# Altium project 单片机+1602+键盘.PrjPCB
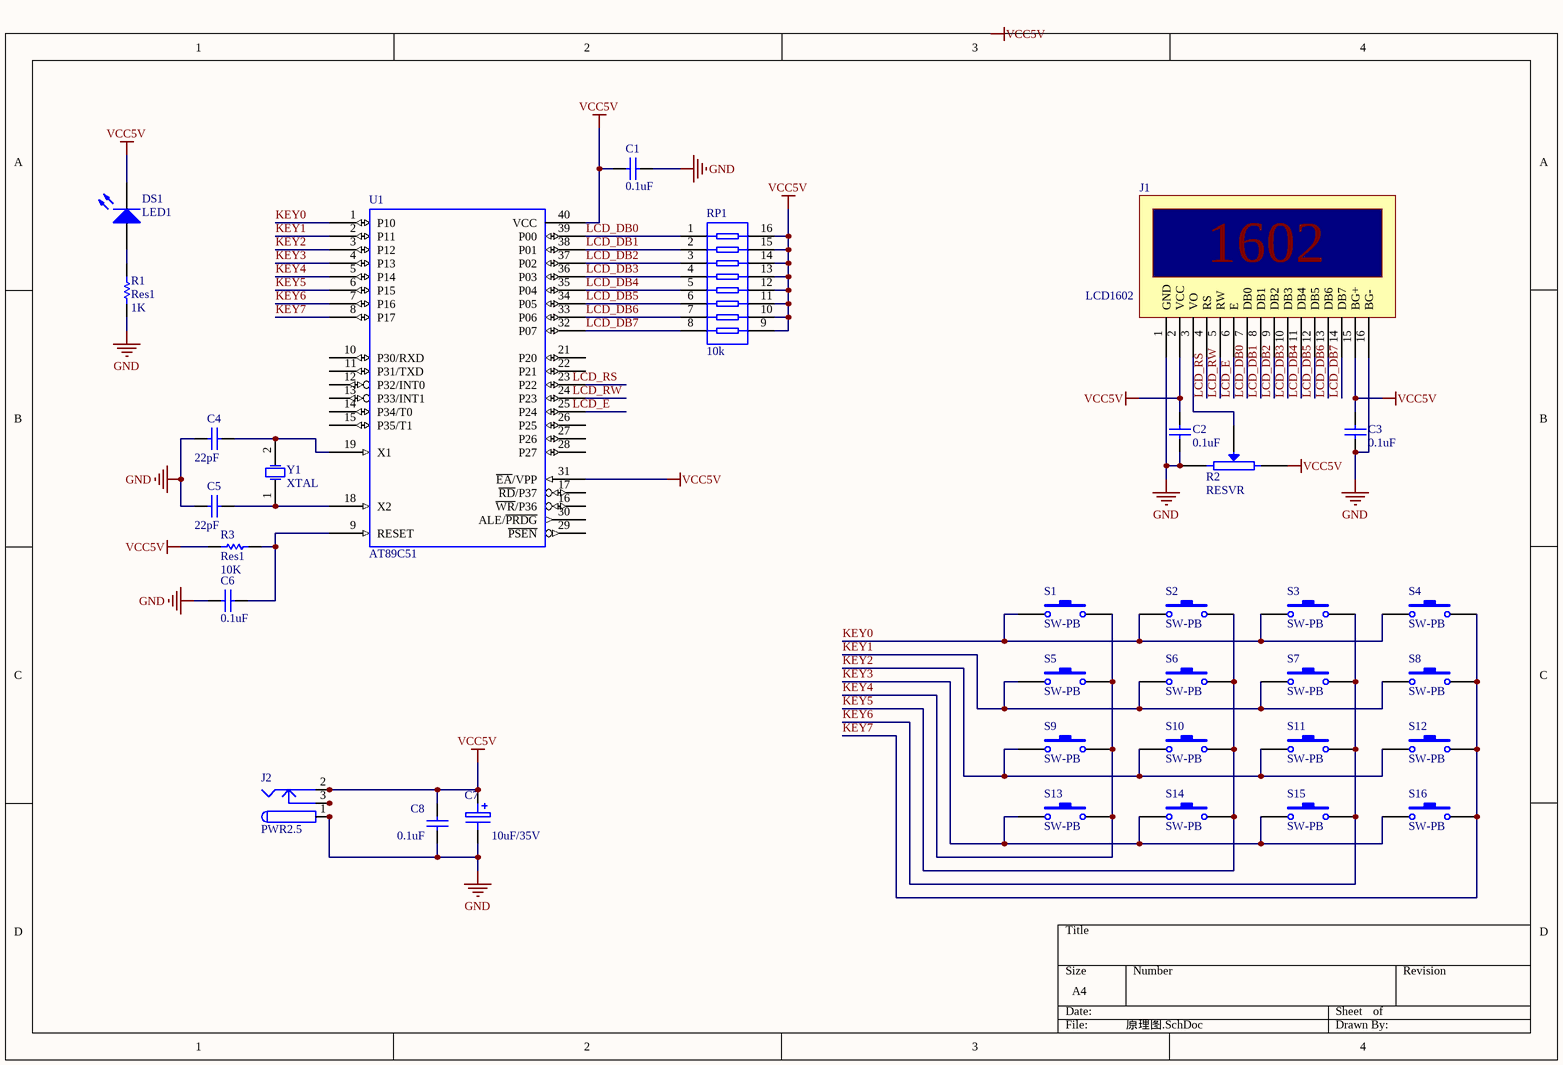
[diagram p0: 原理图.SchDoc]
1 sheet, 33 parts. Net scope: global (net labels, ports and power ports of the same name join across sheets).

## Sheet 原理图.SchDoc
size A4

### Parts
C1  value 0.1uF  [RAD-0.3]  (hidden comment: Cap)
C2  value 0.1uF  [RAD-0.3]  (hidden comment: Cap)
C3  value 0.1uF  [RAD-0.3]  (hidden comment: Cap)
C4  value 22pF  [RAD-0.3]  (hidden comment: Cap)
C5  value 22pF  [RAD-0.3]  (hidden comment: Cap)
C6  value 0.1uF  [RAD-0.3]  (hidden comment: Cap)
C7  10uF/35V  [RB.1/.2]
C8  value 0.1uF  [RAD-0.3]  (hidden comment: Cap)
DS1  LED1  [LED-1]
J1  LCD1602
J2  PWR2.5  [KLD-0202]
R1  Res1  value 1K  [AXIAL-0.3]
R2  RESVR  [VR]
R3  Res1  value 10K  [AXIAL-0.3]
RP1  10k  [DIP16]
S1  SW-PB  [SPST-2]
S2  SW-PB  [SPST-2]
S3  SW-PB  [SPST-2]
S4  SW-PB  [SPST-2]
S5  SW-PB  [SPST-2]
S6  SW-PB  [SPST-2]
S7  SW-PB  [SPST-2]
S8  SW-PB  [SPST-2]
S9  SW-PB  [SPST-2]
S10  SW-PB  [SPST-2]
S11  SW-PB  [SPST-2]
S12  SW-PB  [SPST-2]
S13  SW-PB  [SPST-2]
S14  SW-PB  [SPST-2]
S15  SW-PB  [SPST-2]
S16  SW-PB  [SPST-2]
U1  AT89C51  [DIP-40]
Y1  XTAL  [BCY-W2/D3.1]

### Nets
GND: C1.1 C2.2 C3.2 C4.1 C5.1 C6.2 C7.2(E) C8.2 J1.1(GND) J1.16(BG-) J2.1 J2.1A J2.1B R1.1 R2.1 U1.20(GND)
VCC: U1.40(VCC)
VCC5V: C1.2 C2.1 C3.1 C7.1 C8.1 DS1.2(K) J1.2(VCC) J1.15(BG+) J2.2 J2.2A J2.2B R2.2 R3.1 RP1.9 RP1.10 RP1.11 RP1.12 RP1.13 RP1.14 RP1.15 RP1.16 U1.31(~{EA}/VPP) U1.40(VCC)
KEY0: S1.1 S2.1 S3.1 S4.1 U1.1(P10)
KEY1: S5.1 S6.1 S7.1 S8.1 U1.2(P11)
KEY2: S9.1 S10.1 S11.1 S12.1 U1.3(P12)
KEY3: S13.1 S14.1 S15.1 S16.1 U1.4(P13)
KEY4: S1.2 S5.2 S9.2 S13.2 U1.5(P14)
KEY5: S2.2 S6.2 S10.2 S14.2 U1.6(P15)
KEY6: S3.2 S7.2 S11.2 S15.2 U1.7(P16)
KEY7: S4.2 S8.2 S12.2 S16.2 U1.8(P17)
LCD_DB0: J1.7(DB0) RP1.1 U1.39(P00)
LCD_DB1: J1.8(DB1) RP1.2 U1.38(P01)
LCD_DB2: J1.9(DB2) RP1.3 U1.37(P02)
LCD_DB3: J1.10(DB3) RP1.4 U1.36(P03)
LCD_DB4: J1.11(DB4) RP1.5 U1.35(P04)
LCD_DB5: J1.12(DB5) RP1.6 U1.34(P05)
LCD_DB6: J1.13(DB6) RP1.7 U1.33(P06)
LCD_DB7: J1.14(DB7) RP1.8 U1.32(P07)
LCD_E: J1.6(E)
LCD_RS: J1.4(RS)
LCD_RW: J1.5(RW)
NetC4_2: C4.2 U1.19(X1) Y1.2(OSC2)
NetC5_2: C5.2 U1.18(X2) Y1.1(OSC1)
NetC6_1: C6.1 R3.2 U1.9(RESET)
NetDS1_1: DS1.1(A) R1.2
NetJ1_3: J1.3(VO) R2.3(W)
NetJ2_3: J2.3 J2.3A J2.3B

Not connected (* = marked no-connect by the designer): U1 10(P30/RXD) 11(P31/TXD) 12(P32/INT0) 13(P33/INT1) 14(P34/T0) 15(P35/T1) 16(~{WR}/P36) 17(~{RD}/P37) 21(P20) 22(P21) 23(P22) 24(P23) 25(P24) 26(P25) 27(P26) 28(P27) 29(~{PSEN}) 30(ALE/~{PRDG})

### Notes on the sheet
- Labels drawn without touching a wire or pin: LCD_E, LCD_RS, LCD_RW, VCC5V
- (in symbol LCD1602) 1602

### Library data of the parts
C1-C6 C8 = Cap: Capacitor; Published: 8-Jun-2000; LatestRevisionDate: 17-Jul-2002; LatestRevisionNote: Re-released for DXP Platform.; Publisher: Altium Limited
C7 = EC
DS1 = LED1: Typical RED GaAs LED; Published: 8-Jun-2000; LatestRevisionDate: 17-Jul-2002; LatestRevisionNote: Re-released for DXP Platform.; Publisher: Altium Limited
J2 = PWR2.5: Low Voltage Power Supply Connector; Published: 17-Dec-2003; DatasheetDocument: 09-May-2002; Publisher: Altium Limited
R1 R3 = Res1: Resistor; Published: 8-Jun-2000; LatestRevisionDate: 17-Jul-2002; LatestRevisionNote: Re-released for DXP Platform.; Publisher: Altium Limited
R2 = RESVR: Potentiometer
RP1 = RESPACK4
S1-S16 = SW-PB: Switch; Published: 24-Mar-1999; LatestRevisionDate: 17-Jul-2002; LatestRevisionNote: Re-released for DXP Platform.; Publisher: Altium Limited
Y1 = XTAL: Crystal Oscillator; Published: 8-Jun-2000; LatestRevisionDate: 17-Jul-2002; LatestRevisionNote: Re-released for DXP Platform.; Publisher: Altium Limited